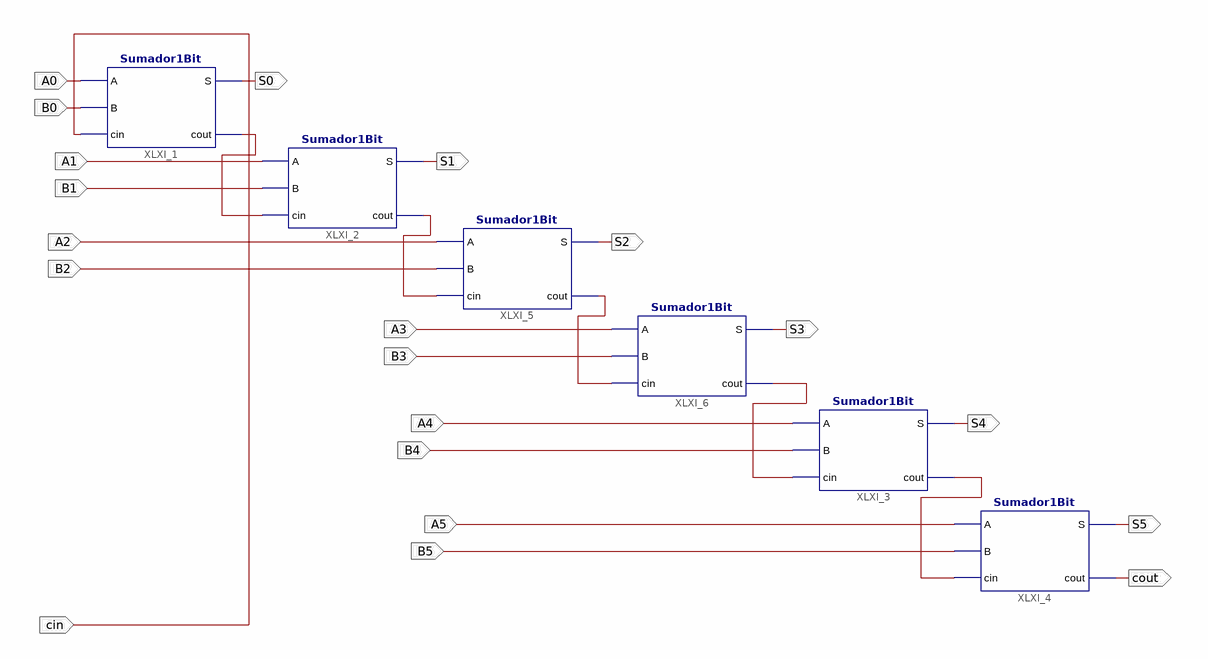
[diagram p0: schematic sheet 1]
// Xilinx ISE schematic Sumador6bits.sch (spartan3e) as structural Verilog: 6 symbols, 20 ports
module Sumador6bits (
  input  A0,
  input  B0,
  input  cin,
  input  A1,
  input  B1,
  input  A2,
  input  B2,
  input  A3,
  input  B3,
  input  A4,
  input  B4,
  input  A5,
  input  B5,
  output S1,
  output S2,
  output S3,
  output S4,
  output S5,
  output cout,
  output S0
);

  wire XLXN_6, XLXN_9, XLXN_12, XLXN_15, XLXN_18;

  Sumador1Bit XLXI_1 (.A(A0), .B(B0), .cin(cin), .S(S0), .cout(XLXN_6));
  Sumador1Bit XLXI_2 (.A(A1), .B(B1), .cin(XLXN_6), .S(S1), .cout(XLXN_9));
  Sumador1Bit XLXI_5 (.A(A2), .B(B2), .cin(XLXN_9), .S(S2), .cout(XLXN_12));
  Sumador1Bit XLXI_6 (.A(A3), .B(B3), .cin(XLXN_12), .S(S3), .cout(XLXN_15));
  Sumador1Bit XLXI_3 (.A(A4), .B(B4), .cin(XLXN_15), .S(S4), .cout(XLXN_18));
  Sumador1Bit XLXI_4 (.A(A5), .B(B5), .cin(XLXN_18), .S(S5), .cout(cout));
endmodule
